# EAGLE design Lichtsensor (EAGLE 6.5.0)
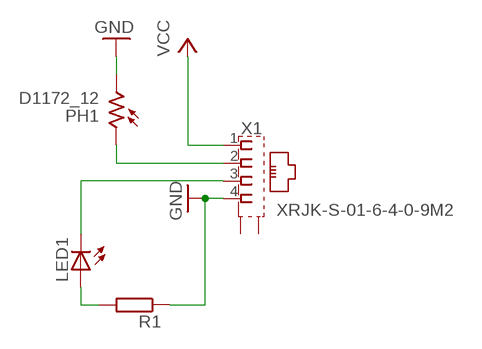
[diagram p0: schematic, sheet 1]

## Parts
LED1  LED5MM  [LED5MM]
PH1  D1172_12  [D11XX]
R1  R-EU_0207/10  [0207/10]
X1  XRJK-S-01-6-4-0-9M2  [XRJK-S-01-6-4-0-9M2]

## Nets
GND: PH1.2 R1.1 X1.4
N$1: PH1.1 X1.2
N$2: LED1.K(C) X1.3
N$3: LED1.A R1.2
VCC: X1.1
Unconnected: X1.S1(S) X1.S2(S)

## Library data of the parts
LED1 = led:LED: LED OSRAM: - CHIPLED LG R971, LG N971, LY N971, LG Q971, LY Q971, LO R971, LY R971 LH N974, LH R974 LS Q976, LO Q976, LY Q976 LO Q996 - Hyper CHIPLED LW Q18S LB Q993, LB Q99A, LB R99A - SideLED LS A670, LO A670, LY A670, LG A670, LP A670 LB A673, LV A673, LT A673, LW A673 LH A674 LY A675 LS A676, LA A676, LO A676, LY A676, LW A676 LS A679, LY A679, LG A679 - Hyper Micro SIDELED® LS Y876, LA Y876, LO Y876, LY Y876 LT Y87S - SmartLED LW L88C, LW L88S LB L89C, LB L89S, LG L890 LS L89K, LO L89K, LY L89K LS L896, LA L896, LO L896, LY L896 - TOPLED LS T670, LO T670, LY T670, LG T670, LP T670 LSG T670, LSP T670, LSY T670, LOP T670, LYG T670 LG T671, LOG T671, LSG T671 LB T673, LV T673, LT T673, LW T673 LH T674 LS T676, LA T676, LO T676, LY T676, LB T676, LH T676, LSB T676, LW T676 LB T67C, LV T67C, LT T67C, LS T67K, LO T67K, LY T67K, LW E67C LS E67B, LA E67B, LO E67B, LY E67B, LB E67C, LV E67C, LT E67C LW T67C LS T679, LY T679, LG T679 LS T770, LO T770, LY T770, LG T770, LP T770 LB T773, LV T773, LT T773, LW T773 LH T774 LS E675, LA E675, LY E675, LS T675 LS T776, LA T776, LO T776, LY T776, LB T776 LHGB T686 LT T68C, LB T68C - Hyper Mini TOPLED® LB M676 - Mini TOPLED Santana® LG M470 LS M47K, LO M47K, LY M47K Source: http://www.osram.convergy.de LUXEON: - LUMILED® LXK2-PW12-R00, LXK2-PW12-S00, LXK2-PW14-U00, LXK2-PW14-V00 LXK2-PM12-R00, LXK2-PM12-S00, LXK2-PM14-U00 LXK2-PE12-Q00, LXK2-PE12-R00, LXK2-PE12-S00, LXK2-PE14-T00, LXK2-PE14-U00 LXK2-PB12-K00, LXK2-PB12-L00, LXK2-PB12-M00, LXK2-PB14-N00, LXK2-PB14-P00, LXK2-PB14-Q00 LXK2-PR12-L00, LXK2-PR12-M00, LXK2-PR14-Q00, LXK2-PR14-R00 LXK2-PD12-Q00, LXK2-PD12-R00, LXK2-PD12-S00 LXK2-PH12-R00, LXK2-PH12-S00 LXK2-PL12-P00, LXK2-PL12-Q00, LXK2-PL12-R00 Source: www.luxeon.com KINGBRIGHT: KA-3528ASYC Source: www.kingbright.com
PH1 = photo-elements:D11: Photo Sensor Oil Burner Control Applications Source: http://optoelectronics.perkinelmer.com/content/Datasheets/DTS_PhotocellsD1160.pdf
R1 = rcl:R-EU_: RESISTOR, European symbol
X1 = con-xmultiple:XRJK*4: RJ11 Connector without LED, 6 position, 4 contacts, thrue hole Source: XRJK-S-01-6-4-0-9M2(01).pdf

## Board
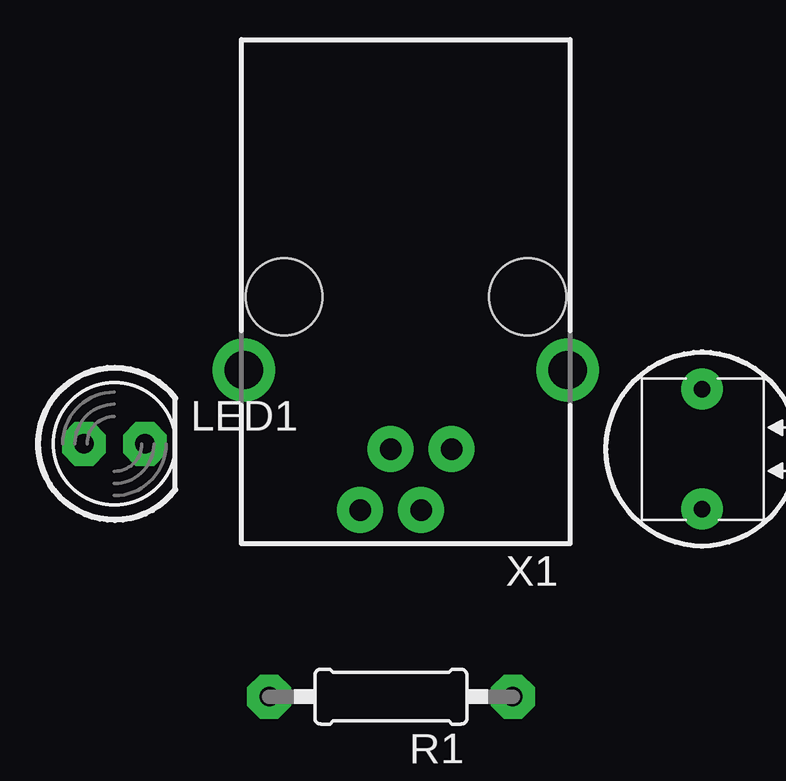
[diagram p1: board, top side]
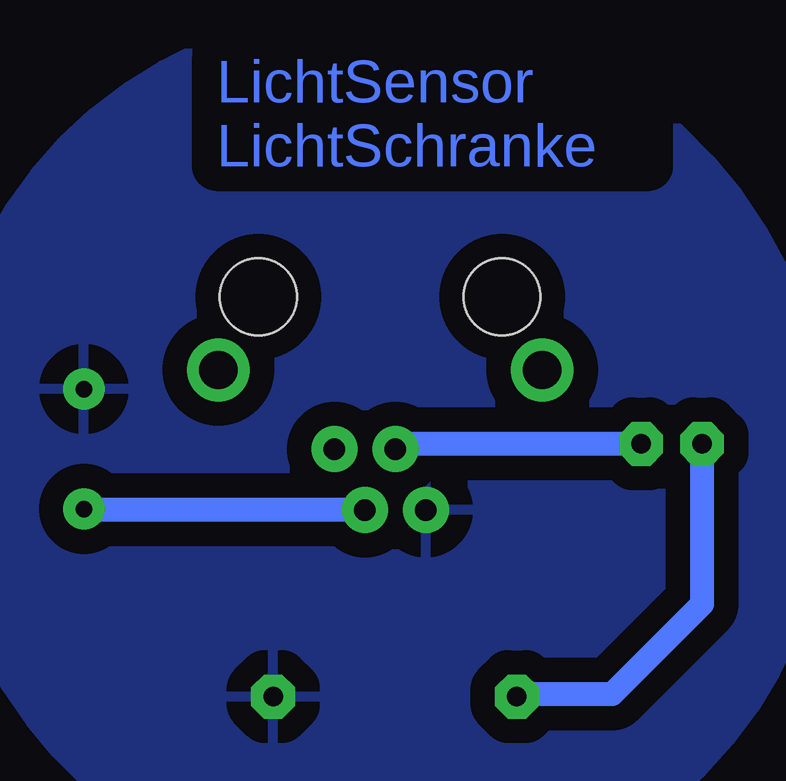
[diagram p2: board, bottom side, seen from below]

No outline drawn. Coordinates in mm, seen from the top.
Copper layers (1*16): Top 0.035mm / dielectric 1.5mm / Bottom 0.035mm
Design rules "default *": minimum track width 30mil, minimum drill 1mm, track to track 40mil, track to pad 40mil, pad to pad 40mil, via to via 40mil, smd to smd 40mil, copper to edge 40mil, drill to drill 8mil, minimum pad ring 20mil, minimum via ring 20mil, stop-mask expansion 4mil, vias tented up to drill 0mil, thermal gap 40mil

### Footprints (pad centres in the part's own frame; a part is rotated, then mirrored left to right if it is on the bottom)
LED5MM = drill 0.813 octagon: A -1.27,0; K 1.27,0
D11XX = drill 0.7 pad 1.4: 1 -2.5,0; 2 2.5,0
0207/10 = drill 0.813 octagon: 1 -5.08,0; 2 5.08,0
XRJK-S-01-6-4-0-9M2 = drill 0.9 pad 1.5: 1 -1.905,6.35; 2 -0.635,8.89; 3 0.635,6.35; 4 1.905,8.89 | drill 1.6 pad 2.184: S1 -6.75,3.05; S2 6.75,3.05 | hole 3.2: -5.08,0; 5.08,0

### Placement (x,y rotation side)
LED1  6.52,18.94 0 top
PH1  31.02,18.72 90 top
R1  18.05,8.4 180 top
X1  18.67,25.07 180 top

### Tracks (layer width: path | path; a pad name or v marks a point on that pad's centre or on a via)
GND
  pour Bottom: 18.5,0 arc90 37,18.5 37,19 arc88 19.5,37 arc93 0,17.5 arc87 17.5,0
N$1
  Bottom 1: X1.2 30.98,16.18 PH1.1
N$2
  Bottom 1: LED1.K 18.04,18.94 X1.3
N$3
  Bottom 1: LED1.A 5.25,12.25 9,8.5 12.87,8.5 R1.2

### Text on the board
Bottom: LichtSensor / LichtSchranke